# EAGLE design Hermès phi - Carte Moteur (EAGLE 6.3)
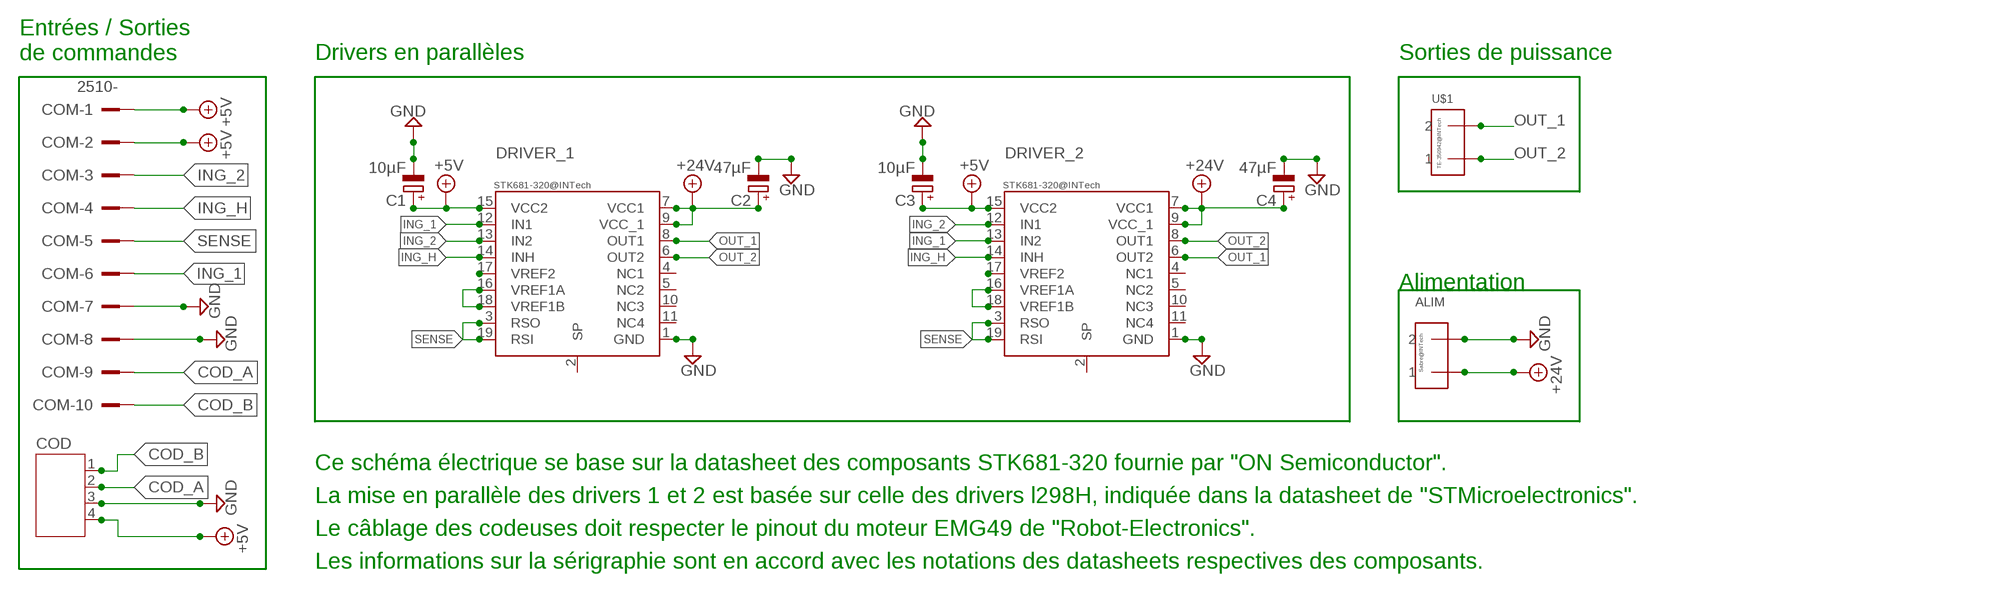
[diagram p0: schematic, sheet 1]

## Parts
ALIM  43160  [43160]
C1  10µF  CPOL-EUE2,5-6E  [E2,5-6E]
C2  47µF  CPOL-EUE2,5-6E  [E2,5-6E]
C3  10µF  CPOL-EUE2,5-6E  [E2,5-6E]
C4  47µF  CPOL-EUE2,5-6E  [E2,5-6E]
COD  JST-PH4  [JST-PH4]
COM  2510-  [PAK100/2500-10]
DRIVER_1  STK681-320  [STK681-320]
DRIVER_2  STK681-320  [STK681-320]
U$1  TE-350942  [350942]

## Nets
+5V: C1.+ C3.+ COD.4 COM.1 COM.2 DRIVER_1.15(VCC2) DRIVER_2.15(VCC2)
+24V: ALIM.1_1 ALIM.1_2 C2.+ C4.+ DRIVER_1.7(VCC1) DRIVER_1.9(VCC_1) DRIVER_2.7(VCC1) DRIVER_2.9(VCC_1)
COD_A: COD.2 COM.9
COD_B: COD.1 COM.10
GND: ALIM.2_1 ALIM.2_2 C1.- C2.- C3.- C4.- COD.3 COM.7 COM.8 DRIVER_1.1(GND) DRIVER_2.1(GND)
ING_1: COM.6 DRIVER_1.12(IN1) DRIVER_2.13(IN2)
ING_2: COM.3 DRIVER_1.13(IN2) DRIVER_2.12(IN1)
ING_H: COM.4 DRIVER_1.14(INH) DRIVER_2.14(INH)
N$5: DRIVER_1.17(VREF2)
N$6: DRIVER_1.16(VREF1A) DRIVER_1.18(VREF1B)
N$19: DRIVER_2.17(VREF2)
N$20: DRIVER_2.16(VREF1A) DRIVER_2.18(VREF1B)
OUT_1: DRIVER_1.8(OUT1) DRIVER_2.6(OUT2) U$1.2
OUT_2: DRIVER_1.6(OUT2) DRIVER_2.8(OUT1) U$1.1
SENSE: COM.5 DRIVER_1.3(RSO) DRIVER_1.19(RSI) DRIVER_2.3(RSO) DRIVER_2.19(RSI)
Unconnected: DRIVER_1.2(SP) DRIVER_1.4(NC1) DRIVER_1.5(NC2) DRIVER_1.10(NC3) DRIVER_1.11(NC4) DRIVER_2.2(SP) DRIVER_2.4(NC1) DRIVER_2.5(NC2) DRIVER_2.10(NC3) DRIVER_2.11(NC4)

## Notes on the sheet
- Entrées / Sorties 
  de commandes
- Drivers en parallèles | Sorties de puissance
- Alimentation
- Ce schéma électrique se base sur la datasheet des composants STK681-320 fournie par "ON Semiconductor".
- La mise en parallèle des drivers 1 et 2 est basée sur celle des drivers l298H, indiquée dans la datasheet de "STMicroelectronics".
- Le câblage des codeuses doit respecter le pinout du moteur EMG49 de "Robot-Electronics".
- Les informations sur la sérigraphie sont en accord avec les notations des datasheets respectives des composants.

## Library data of the parts
ALIM = con-molex-sabre:43160: Connecteur Molex Sabre, Droit, 2 contacts, 7.49 mm
C1-C4 = resistor:CPOL-EU: POLARIZED CAPACITOR, European symbol
COD = con-jst-ph:JST-PH4
COM = con-3m:2510-: 3M (TM) Pak 100 4-Wall Header Source: 3M; MF: 3M; MPN: 2510-6002UB; OC_FARNELL: 9838244; OC_NEWARK: 46F4725
DRIVER_1 DRIVER_2 = STK681-320_CF:STK681-320: STK681-320 driver device
U$1 = con-te-connectivity:TE-350942: Embase TE Connectivity Mate-n-Lok, 2 contacts, angle droit, 6.35 mm

## Board
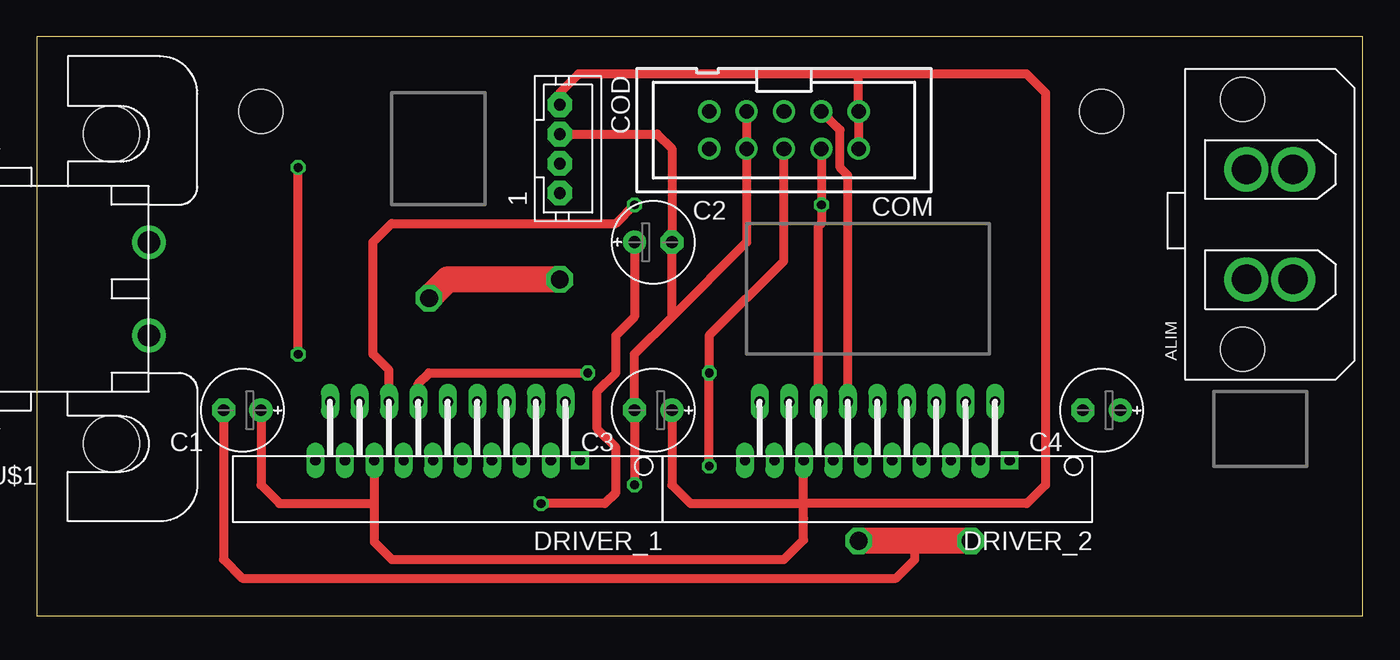
[diagram p1: board, top side]
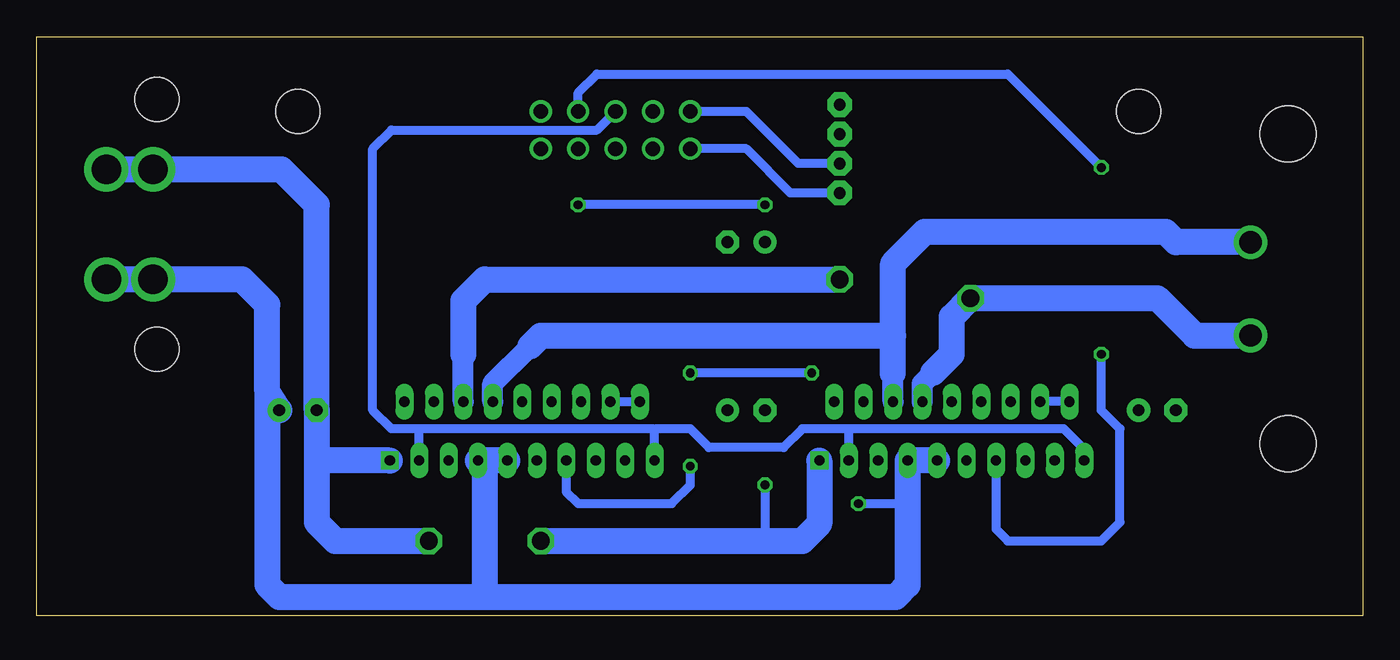
[diagram p2: board, bottom side, seen from below]

Size 90.15 x 39.37 mm. Coordinates in mm from the lower left corner, seen from the top.
Outline: 0,0 90.15,0 90.15,39.37 0,39.37 0,0
Copper layers (1*16): Top 0.035mm / dielectric 1.5mm / Bottom 0.035mm
Design rules "default *": minimum track width 8mil, minimum drill 18mil, track to track 8mil, track to pad 8mil, pad to pad 8mil, via to via 8mil, smd to smd 8mil, copper to edge 8mil, drill to drill 8mil, minimum pad ring 10mil, minimum via ring 8mil, stop-mask expansion 4mil, vias tented up to drill 0mil, thermal gap 10mil
Holes 3 mm at 72.39,34.29 15.24,34.29

### Footprints (pad centres in the part's own frame; a part is rotated, then mirrored left to right if it is on the bottom)
43160 = drill 2: 1_1 -3.81,-1.6; 1_2 -3.81,1.575; 2_1 3.683,-1.6; 2_2 3.683,1.575 | hole 3: -8.56,1.829; 8.433,1.829
E2,5-6E = drill 0.813 pad 1.575: + -1.27,0 | drill 0.813 pad 1.575 octagon: - 1.27,0
JST-PH4 = drill 0.813 pad 1.676 octagon: 1 3,0; 2 1,0; 3 -1,0; 4 -3,0
PAK100/2500-10 = drill 1 pad 1.422: 1 -5.08,-1.27; 2 -5.08,1.27; 3 -2.54,-1.27; 4 -2.54,1.27; 5 0,-1.27; 6 0,1.27; 7 2.54,-1.27; 8 2.54,1.27; 9 5.08,-1.27; 10 5.08,1.27
STK681-320 = drill 0.7 square: 1 -9,-4.2 | drill 0.7 long: 2 -8,-8.2; 3 -7,-4.2; 4 -6,-8.2; 5 -5,-4.2; 6 -4,-8.2; 7 -3,-4.2; 8 -2,-8.2; 9 -1,-4.2; 10 0,-8.2; 11 1,-4.2; 12 2,-8.2; 13 3,-4.2; 14 4,-8.2; 15 5,-4.2; 16 6,-8.2; 17 7,-4.2; 18 8,-8.2; 19 9,-4.2
350942 = drill 1.524: 1 0,3.81; 2 0,10.16 | hole 3.81: 2.54,17.526; 2.54,-3.556

### Placement (x,y rotation side)
ALIM  83.82,26.67 90 top
C1  13.97,13.97 180 top
C2  41.91,25.4 0 top
C3  41.91,13.97 180 top
C4  72.39,13.97 180 top
COD  35.56,31.75 270 top
COM  50.8,33.02 180 top
DRIVER_1  27.94,6.35 180 top
DRIVER_2  57.15,6.35 180 top
U$1  7.62,29.21 180 top

### Tracks (layer width: path | path; a pad name or v marks a point on that pad's centre or on a via)
+5V
  Top 0.61: 52.12,7.61 52.13,6.59 52.13,5.14 50.8,3.81 24.13,3.81 22.94,5 22.94,7.62 | 52.12,7.61 52.12,7.87 52.12,10.52 DRIVER_2.15 | 52.12,7.61 52.13,7.62 67.31,7.62 68.58,8.89 68.58,35.56 67.31,36.83 55.88,36.83 | C3.+ 43.18,8.89 44.45,7.62 52.11,7.62 52.12,7.61 | DRIVER_1.15 22.94,7.62 | C1.+ 15.24,8.89 16.51,7.62 22.94,7.62 | COM.2 COM.1 55.88,36.83 | 55.88,36.83 36.83,36.83 35.56,35.56 COD.4
+24V  (via drill 0.6)
  Top 0.61: C2.+ 40.64,20.32 39.37,19.05 39.37,16.51 38.1,15.24 38.1,12.7 39.37,11.43 39.37,8.36 38.63,7.62 v34.29,7.62
  Bottom 0.61: v34.29,7.62 30.94,7.62
  Bottom 1.778: 59.69,1.27 73.66,1.27 74.49,2.1 74.49,15.24 | 59.69,1.27 31.75,1.27 30.94,2.08 30.94,7.62 DRIVER_1.7 DRIVER_1.9 | DRIVER_2.9 DRIVER_2.7 59.69,10.55 59.69,1.27 | C4.+ 74.49,15.24 | 74.49,15.24 74.49,21.14 76.2,22.86 ALIM.1_2 ALIM.1_1
COD_A
  Bottom 0.61: COD.2 38.37,30.75 41.91,34.29 COM.9
COD_B
  Bottom 0.61: COD.1 38.91,28.75 41.91,31.75 COM.10
GND  (via drill 0.6, 1.2)
  Top 0.61: 59.69,5.08 59.69,3.81 58.42,2.54 13.97,2.54 12.7,3.81 C1.- | v40.64,8.89 C3.- 40.64,17.78 43.18,20.32 | 43.18,20.32 C2.- 43.18,31.75 42.18,32.75 COD.3 | COM.7 COM.8 48.26,25.4 43.18,20.32
  Top 1.778: v63.5,5.08 59.69,5.08 v55.88,5.08
  Bottom 0.61: v40.64,8.89 40.64,5.08
  Bottom 1.778: 71.12,10.16 C4.- 71.12,27.94 73.53,30.35 ALIM.2_2 ALIM.2_1 | 71.12,10.16 71.12,6.35 69.85,5.08 v63.5,5.08 | v55.88,5.08 40.64,5.08 38.1,5.08 36.94,6.24 DRIVER_1.1 | DRIVER_2.1 70.73,10.55 71.12,10.16
ING_1  (via drill 0.6)
  Top 0.61: v45.72,10.16 v45.72,16.51 45.72,19.05 50.8,24.13 COM.6 | DRIVER_1.12 25.94,15.78 26.67,16.51 v37.47,16.51
  Bottom 0.61: DRIVER_2.13 54.15,8.43 53.34,7.62 46.99,7.62 45.72,8.89 v45.72,10.16 | v37.47,16.51 v45.72,16.51
ING_2  (via drill 0.6)
  Top 0.61: DRIVER_2.12 55.15,29.94 54.61,30.48 54.61,33.02 COM.3 | v17.78,17.78 v17.78,30.48
  Bottom 0.61: DRIVER_1.13 24.94,5.89 24.13,5.08 17.78,5.08 16.51,6.35 16.51,12.7 17.78,13.97 v17.78,17.78 | COM.3 53.34,35.56 52.07,36.83 24.13,36.83 v17.78,30.48
ING_H  (via drill 0.6)
  Top 0.61: DRIVER_2.14 53.15,26.48 53.34,26.67 v53.34,27.94 COM.4 | DRIVER_1.14 23.94,16.7 22.86,17.78 22.86,25.4 24.13,26.67 39.37,26.67 v40.64,27.94
  Bottom 0.61: v40.64,27.94 v53.34,27.94
N$6
  Bottom 0.61: DRIVER_1.18 DRIVER_1.16
N$20
  Bottom 0.61: DRIVER_2.16 DRIVER_2.18
OUT_1  (via drill 1.2)
  Top 1.778: v35.56,22.86 27.94,22.86 v26.67,21.59
  Bottom 1.422: DRIVER_1.8 29.94,15.78 29.21,16.51 | DRIVER_2.6 61.15,17.77 61.14,17.78
  Bottom 1.778: v35.56,22.86 59.69,22.86 61.15,21.4 61.14,21.39 61.14,17.78 | 29.21,16.51 27.94,17.78 27.94,20.32 v26.67,21.59 13.97,21.59 11.43,19.05 U$1.2
OUT_2
  Bottom 1.422: DRIVER_1.6 31.94,16.48 31.95,16.48 | DRIVER_2.8 59.15,15.78 56.61,18.32
  Bottom 1.778: 31.95,19.05 55.88,19.05 56.61,18.32 | 31.95,16.48 31.95,19.05 | 31.95,19.05 31.94,19.05 31.94,23.94 29.77,26.11 13.41,26.11 12.7,25.4 U$1.1
SENSE
  Bottom 0.61: DRIVER_1.19 18.94,11.32 20.32,12.7 34.92,12.7 | 64.19,12.7 48.26,12.7 48.15,12.59 | 64.19,12.7 66.04,12.7 67.31,13.97 67.31,31.75 66.04,33.02 52.07,33.02 COM.5 | DRIVER_2.3 64.15,12.66 64.19,12.7 | DRIVER_2.19 48.15,12.59 | DRIVER_1.3 34.94,12.69 34.92,12.7 | 34.92,12.7 38.1,12.7 39.37,11.43 44.45,11.43 45.72,12.7 48.04,12.7 48.15,12.59
(copper drawn outside any net)
  shapes: Serigraphie area x1576

### Text on the board
tDocu: 4. +5V | 1. | 3. GND | 2. | 2. A | 1. B | 10.COD_B / 9. COD_A / 8. GND / 7. GND / 6. ING_1 / 5. SENSE / 4. ING_H / 3. ING_2 / 2. +5V / 1. +5V | 2. GND | 1. +24V | HERMES PHI / MOTEUR